# EAGLE design PCB_RIGID (EAGLE 9.5.2)
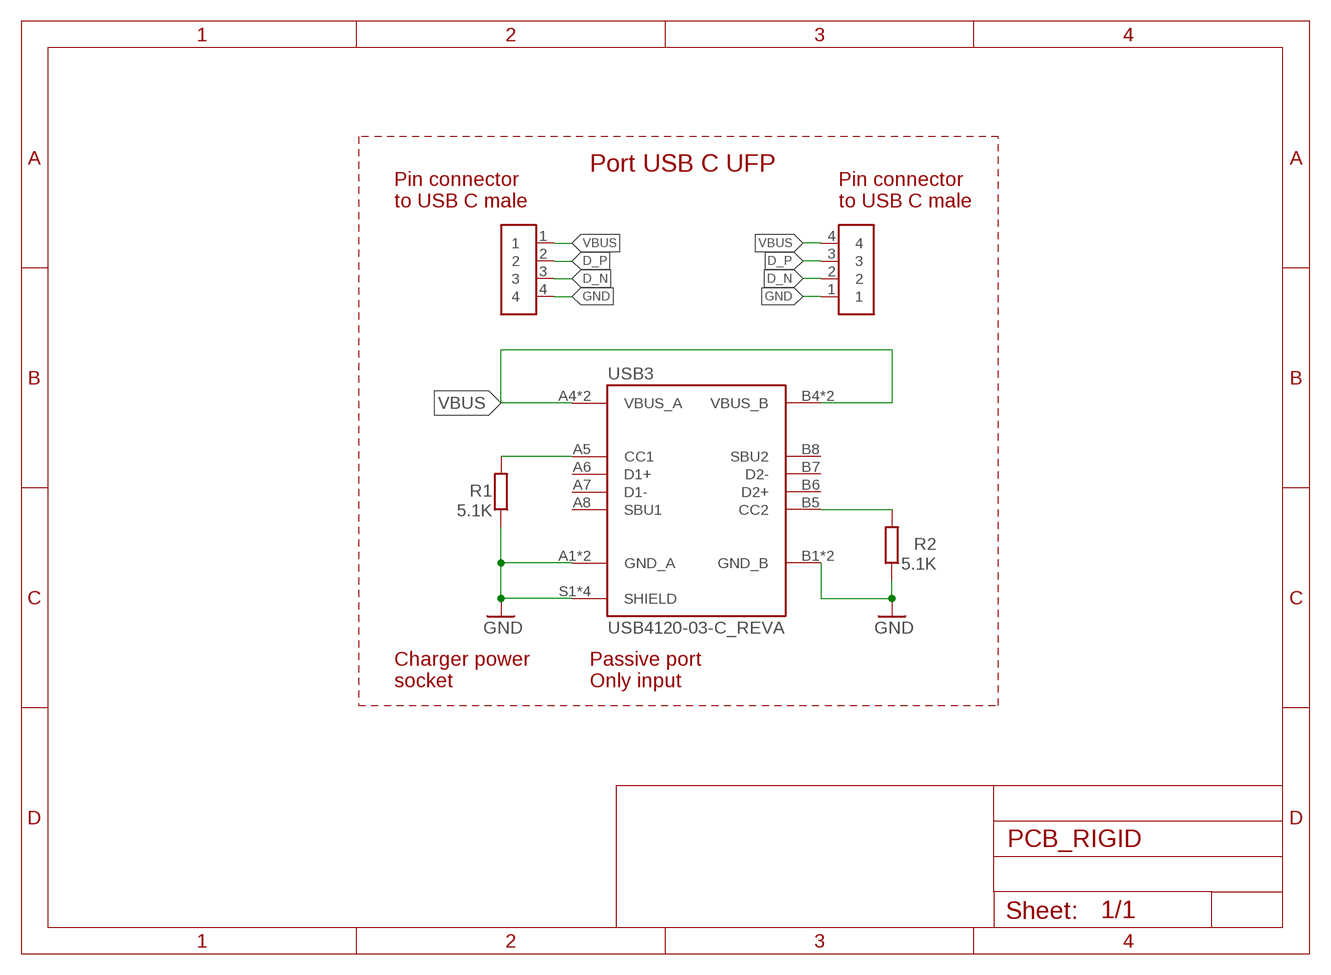
[diagram p0: schematic, sheet 1]

## Parts
R1  5.1K  R_0603  [R0603]
R2  5.1K  R_0603  [R0603]
USB1  CONN_FLEX_2.5MM  [CONN_FLEX_2.5MM]
USB2  CONN_FLEX_2.5MM  [CONN_FLEX_2.5MM]
USB3  USB4120-03-C_REVA  [GCT_USB4120-03-C_REVA]

## Nets
D_N [USB]: USB1.3 USB2.2
D_P [USB]: USB1.2 USB2.3
GND: R1.1 R2.1 USB1.4 USB2.1 USB3.A1(GND_A) USB3.A12(GND_A) USB3.B1(GND_B) USB3.B12(GND_B) USB3.S1(SHIELD) USB3.S2(SHIELD) USB3.S3(SHIELD) USB3.S4(SHIELD)
N$1: R1.2 USB3.A5(CC1)
N$2: R2.2 USB3.B5(CC2)
VBUS: USB1.1 USB2.4 USB3.A4(VBUS_A) USB3.A9(VBUS_A) USB3.B4(VBUS_B) USB3.B9(VBUS_B)
Unconnected: USB3.A6(D1+) USB3.A7(D1-) USB3.A8(SBU1) USB3.B6(D2+) USB3.B7(D2-) USB3.B8(SBU2)

## Notes on the sheet
- Port USB C UFP
- Pin connector
  to USB C male
- Pin connector
  to USB C male
- Charger power 
  socket
- Passive port
  Only input

## Library data of the parts
R1 R2 = OTG_C:R_0603: R_0603
USB1 USB2 = OTG_C:CONN_FLEX_2.5MM
USB3 = OTG_C:USB4120-03-C_REVA: Check prices <https://pricing.snapeda.com/parts/USB4120-03-C/Global%20Connector%20Technology/view-part?ref=eda>; AVAILABILITY: In Stock; DESCRIPTION: USB 2.0 Connector Type C Vertical Receptacle, 6.50mm profile, 16 Pins, Surface mount, Top mount, low profile, low cost; MF: Global Connector Technology; MP: USB4120-03-C; PACKAGE: None; PRICE: None; PURCHASE-URL: https://pricing.snapeda.com/search/part/USB4120-03-C/?ref=eda

## Net classes
1 USB: width 0.127 mm, drill 0.127 mm, clearance 0.127 mm

## Board
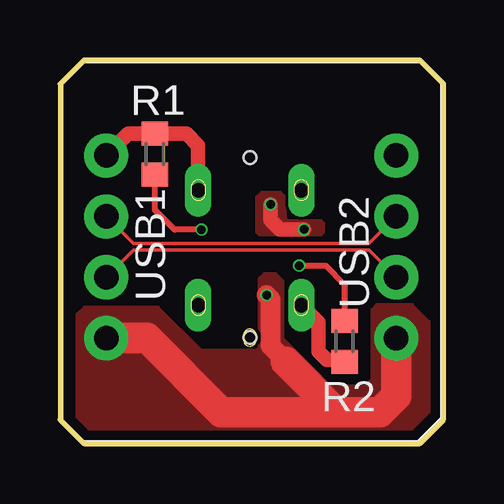
[diagram p1: board, top side]
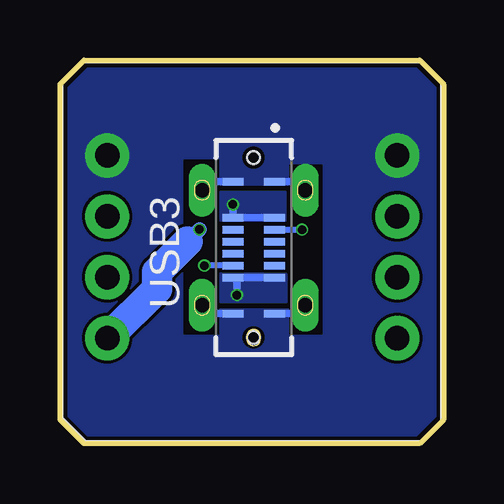
[diagram p2: board, bottom side, seen from below]

Size 16 x 16 mm. Coordinates in mm from the lower left corner, seen from the top.
Outline: 15,16 1,16 0,15 0,1 1,0 15,0 16,1 16,15 15,16
Copper layers (1*16): Top 0.035mm / dielectric 0.8mm / Bottom 0.035mm
Design rules "jlcpcb-2layers *": minimum track width 5mil, minimum drill 0.3mm, track to track 5mil, track to pad 5mil, pad to pad 5mil, via to via 5mil, smd to smd 5mil, copper to edge 0.2mm, drill to drill 6mil, minimum pad ring 10mil, minimum via ring 3mil, stop-mask expansion 4mil, vias tented up to drill 0mil, thermal gap 10mil

### Footprints (pad centres in the part's own frame; a part is rotated, then mirrored left to right if it is on the bottom)
R0603 = smd 1 x 1.1: 1 -0.85,0; 2 0.85,0
CONN_FLEX_2.5MM = drill 1.02: 1 0,0; 2 2.54,0; 3 5.08,0; 4 7.62,0
GCT_USB4120-03-C_REVA = smd 0.3 x 0.87: A1 -2.75,0.865; A4 -1.25,0.865; A5 -0.75,0.865; A6 -0.25,0.865; A7 0.25,0.865; A8 0.75,0.865; A9 1.25,0.865; A12 2.75,0.865; B1 2.75,-0.865; B4 1.25,-0.865; B5 0.75,-0.865; B6 0.25,-0.865; B7 -0.25,-0.865; B8 -0.75,-0.865; B9 -1.25,-0.865; B12 -2.75,-0.865 | drill 0.6 pad 1.1 long: S1 -2.4,2.15; S2 -2.4,-2.15; S3 2.4,2.15; S4 2.4,-2.15 | hole 0.52: -3.75,0; 3.75,0

### Placement (x,y rotation side)
R1  3.96,12.07 270 top
R2  11.87,4.27 90 top
USB1  1.94,4.4 90 top
USB2  14.03,12.02 270 top
USB3  7.92,8.17 270 bottom

### Tracks (layer width: path | path; a pad name or v marks a point on that pad's centre or on a via)
D_N
  Top 0.152: USB1.3 3.06,8.35 12.89,8.35 USB2.2
D_P
  Top 0.152: USB1.2 3.06,8.07 12.89,8.07 USB2.3
GND
  Top 0.61: R2.1 11.79,3.49 11.13,3.49 10.78,3.84 10.78,5.06 USB3.S4 | USB3.S1 5.77,12.43 5.28,12.92 R1.1 2.84,12.92 USB1.4
  Bottom 0.305: USB3.B1 9.72,5.42 USB3.S4 | USB3.A12 6.12,5.42 USB3.S3 | USB3.A1 6.12,10.92 USB3.S1 | USB3.B12 9.72,10.92 USB3.S2
  pour Bottom (no thermals): 9.3,5.6 9.3,4.5 10.6,4.5 10.9,4.5 10.9,11.6 10.9,11.9 9.3,11.9 9.3,10.8 6.5,10.8 6.5,15.9 14.9,15.9 15.9,14.9 15.9,14.8 15.9,1.1 14.9,0.1 6.5,0.1 6.5,5.6
  pour Bottom (no thermals): 5,4.5 6.4,4.5 6.4,3.9 6.4,0.1 1.1,0.1 0.1,1.1 0.1,1.4 0.1,15 1,15.9 6.4,15.9 6.4,11.8 6.4,11.7 5.3,11.7 5,11.7
N$1  (via drill 0.35)
  Top 0.254: v5.9,8.92 4.79,8.92 3.96,9.75 R1.2
  Bottom 0.254: USB3.A5 v5.91,8.92 v5.9,8.92
N$2  (via drill 0.35)
  Top 0.254: v9.98,7.42 11.09,7.42 11.87,6.64 R2.2
  Bottom 0.254: USB3.B5 v9.98,7.42
VBUS  (via drill 0.35)
  Top 0.61: v8.79,9.98 8.79,9.32 9.18,8.93 v10.18,8.93
  Top 0.813: v8.62,6.2 8.79,6.03 8.79,4.08 9.42,3.45 9.42,3.41
  Top 1.27: USB1.1 3.64,4.4 6.72,1.31 11.52,1.31 | USB2.4 14.03,2 13.34,1.31 11.52,1.31 | 9.42,3.41 11.52,1.31
  Bottom 0.305: USB3.A4 USB3.B9 v8.79,9.98 | USB3.A9 USB3.B4 8.62,6.76 v8.62,6.2 | v8.79,9.98
  Bottom 0.61: v10.18,8.93 10.68,8.43 10.69,8.43
  Bottom 1.27: 10.69,8.43 11.95,7.16 11.95,6.45 14,4.4 USB2.4
  pour Top (no thermals): 0.7,5.4 0.7,1.1 1.2,0.6 14.7,0.6 15.4,1.3 15.4,5.1 14.7,5.8 13.2,5.8 13,5.6 13,2.7 12.7,2.4 11.3,2.4 9.3,4.4 9.3,6.8 9,7.1 8.5,7.1 8.3,6.9 8.3,4 8.2,3.9 5.9,3.9 4.1,5.7 1,5.7
  pour Top: 8.2,10.3 8.2,8.8 8.3,8.7 10.9,8.7 11,8.8 11,9.2 10.9,9.3 9.5,9.3 9.4,9.4 9.4,10.3 9.2,10.5 8.4,10.5
  pour Bottom (no thermals): 6.55,7.06 6.55,5.9 9.3,5.9 9.3,7.1 6.6,7.1
  pour Bottom (no thermals): 6.6,9.3 9.3,9.3 9.3,10.5 6.6,10.5